# Altium schematic sheet Overview.SchDoc
size A; SheetNumber: 1; SheetTotal: 6
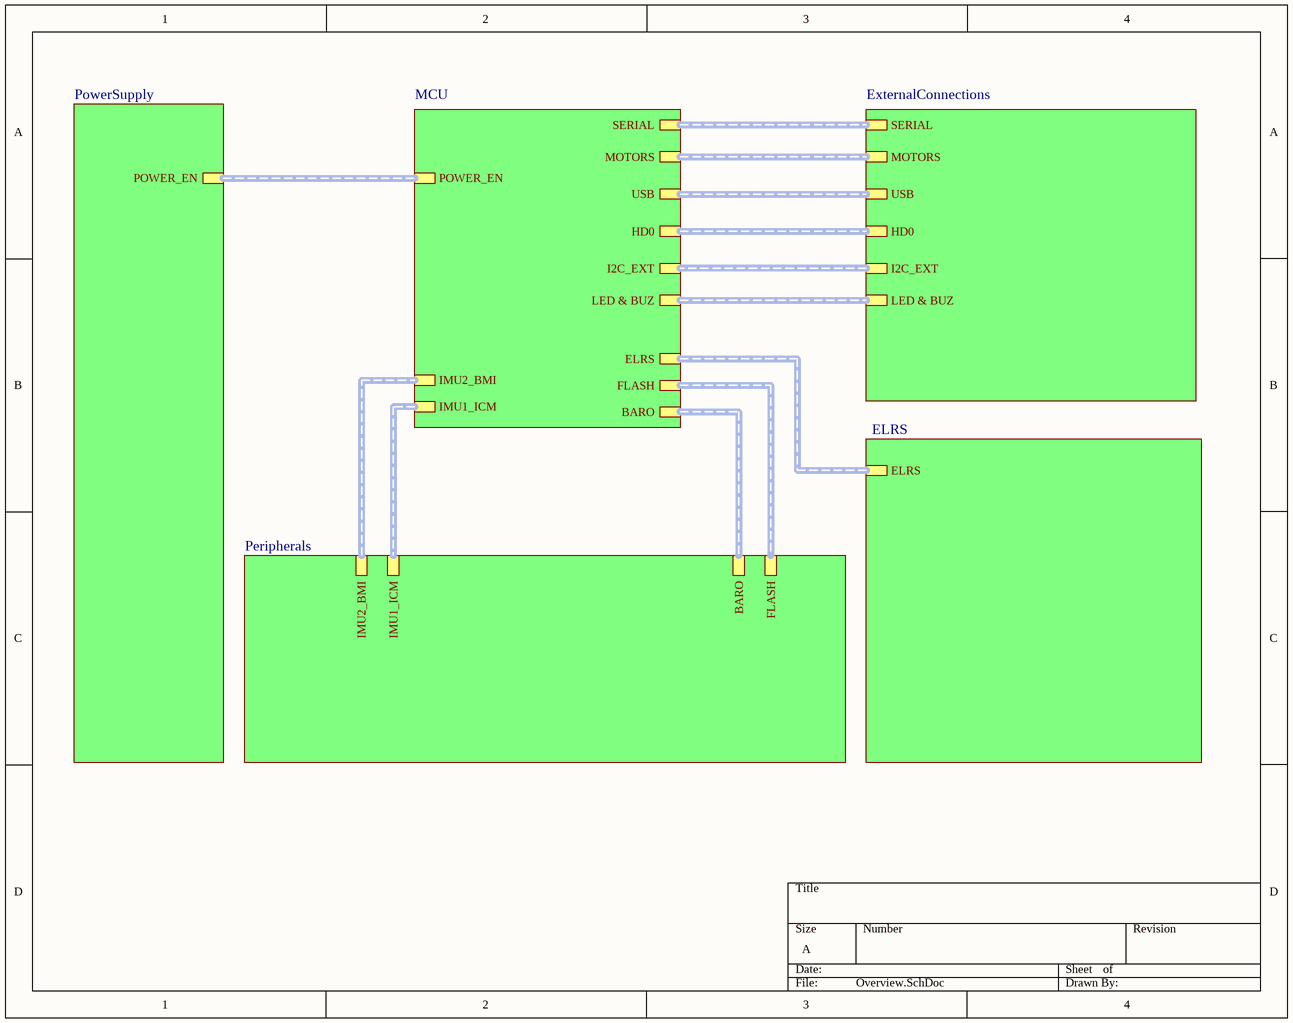
[diagram p0: Overview.SchDoc]

## Sub-sheets
Ex = ExternalConnections: MOTORS, USB, HD0, I2C_EXT, LED & BUZ, SERIAL
M1 = MCU: IMU2_BMI, IMU1_ICM, BARO, FLASH, MOTORS, ELRS, USB, HD0, I2C_EXT, LED & BUZ, SERIAL, POWER_EN
P1 = Peripherals: IMU2_BMI, IMU1_ICM, BARO, FLASH
Pw = PowerSupply: POWER_EN
RC = ELRS: ELRS

## Buses and harness runs
harness sheet Ex/HD0 = sheet M1/HD0
harness sheet Ex/I2C_EXT = sheet M1/I2C_EXT
harness sheet Ex/LED & BUZ = sheet M1/LED & BUZ
harness sheet Ex/MOTORS = sheet M1/MOTORS
harness sheet Ex/SERIAL = sheet M1/SERIAL
harness sheet Ex/USB = sheet M1/USB
harness sheet M1/BARO = sheet P1/BARO
harness sheet M1/ELRS = sheet RC/ELRS
harness sheet M1/FLASH = sheet P1/FLASH
harness sheet M1/IMU1_ICM = sheet P1/IMU1_ICM
harness sheet M1/IMU2_BMI = sheet P1/IMU2_BMI
harness sheet M1/POWER_EN = sheet Pw/POWER_EN